# EAGLE design Rigol DL3021 Binding Post to Banana Jack (EAGLE 9.4.0)
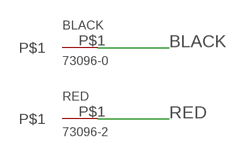
[diagram p0: schematic, sheet 1]

## Parts
BLACK  73096-0  73096  [TH]
RED  73096-2  73096  [TH]

## Nets
BLACK: BLACK.P$1
RED: RED.P$1

## Library data of the parts
BLACK RED = 73096 - 4mm Safety Jack for PCB:73096

## Board
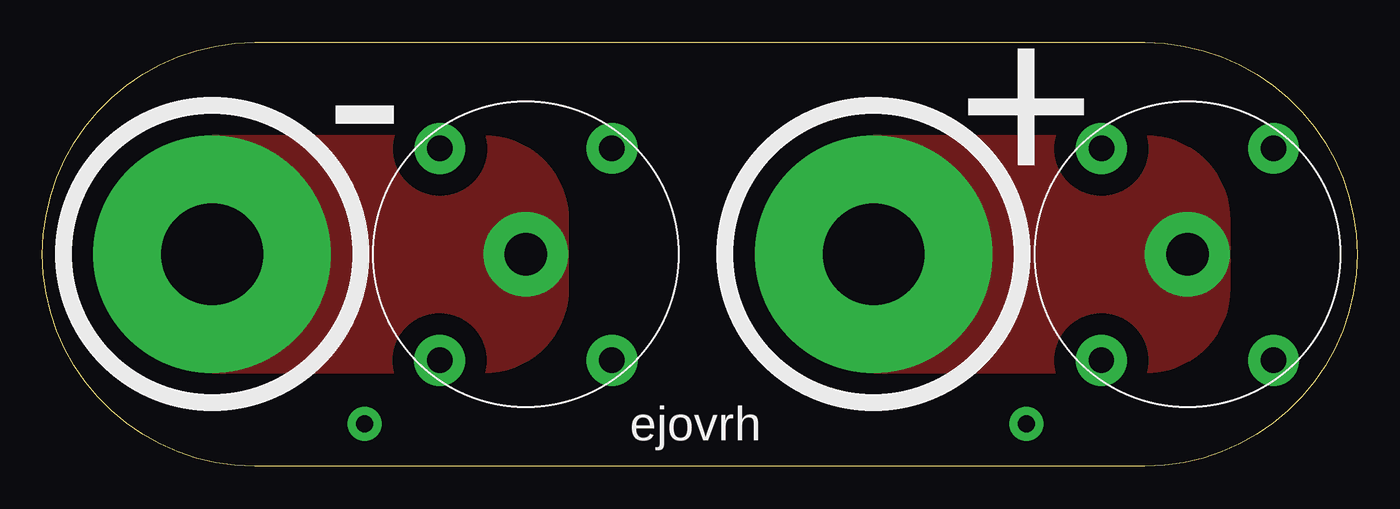
[diagram p1: board, top side]
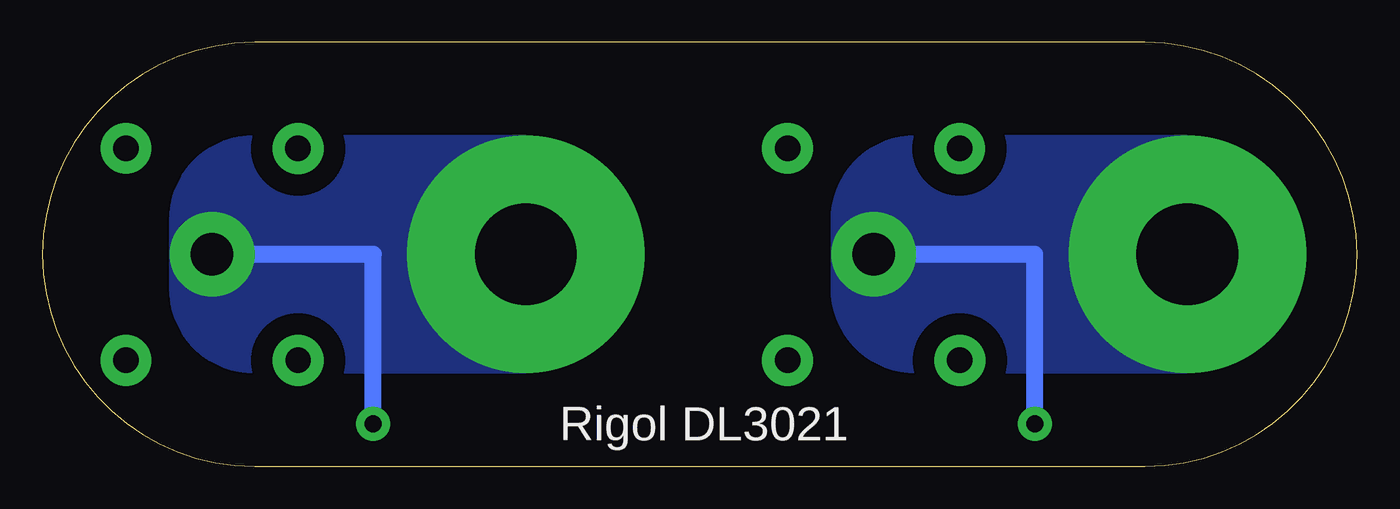
[diagram p2: board, bottom side, seen from below]

Size 77.5 x 25 mm. Coordinates in mm from the lower left corner, seen from the top.
Outline: 12.5,25 65,25 arc-90 77.5,12.5 arc-90 65,0 12.5,0 arc-90 0,12.5 arc-90 12.5,25
Copper layers (1*16): Top 0.035mm / dielectric 1.5mm / Bottom 0.035mm
Design rules "markovac_2layer": minimum track width 0.2mm, minimum drill 0.35mm, track to track 0.2mm, track to pad 0.2mm, pad to pad 0.2mm, via to via 0.2mm, smd to smd 0.2mm, copper to edge 0.5mm, drill to drill 8mil, minimum pad ring 0.15mm, minimum via ring 0.15mm, stop-mask expansion 4mil, vias tented up to drill 0.34mm, thermal gap 10mil

### Footprints (pad centres in the part's own frame; a part is rotated, then mirrored left to right if it is on the bottom)
TH = drill 1.5 pad 3: NC1 -6.25,5.075; NC2 6.245,5.07; NC3 6.25,-5.075; NC4 -6.25,-5.075 | drill 2.5 pad 5: P$1 0,0

### Placement (x,y rotation side)
BLACK  28.5,12.5 90 top
RED  67.5,12.5 90 top

### Tracks (layer width: path | path; a pad name or v marks a point on that pad's centre or on a via)
BLACK  (via drill 1 pad 2, 6 pad 14)
  Bottom 1.016: v19,2.5 19,12.5 BLACK.P$1
  other vias: 10,12.5
  pour Top (isolate 1.27, no thermals): 10,19.5 26,19.5 arc-90 31,14.5 31,10.5 arc-90 26,5.5 10,5.5
  pour Bottom (isolate 1.27, no thermals): 10,19.5 26,19.5 arc-90 31,14.5 31,10.5 arc-90 26,5.5 10,5.5
RED  (via drill 1 pad 2, 6 pad 14)
  Bottom 1.016: v58,2.5 58,12.5 RED.P$1
  other vias: 49,12.5
  pour Top (isolate 1.27, no thermals): 49,19.5 65,19.5 arc-90 70,14.5 70,10.5 arc-90 65,5.5 49,5.5
  pour Bottom (isolate 1.27, no thermals): 49,5.5 65,5.5 arc90 70,10.5 70,14.5 arc90 65,19.5 49,19.5

### Text on the board
tPlace: - | + | ejovrh
bPlace: Rigol DL3021